# Altium schematic sheet RESET-SWITCHES.SchDoc
size A4; SheetNumber: 3; SheetTotal: 3
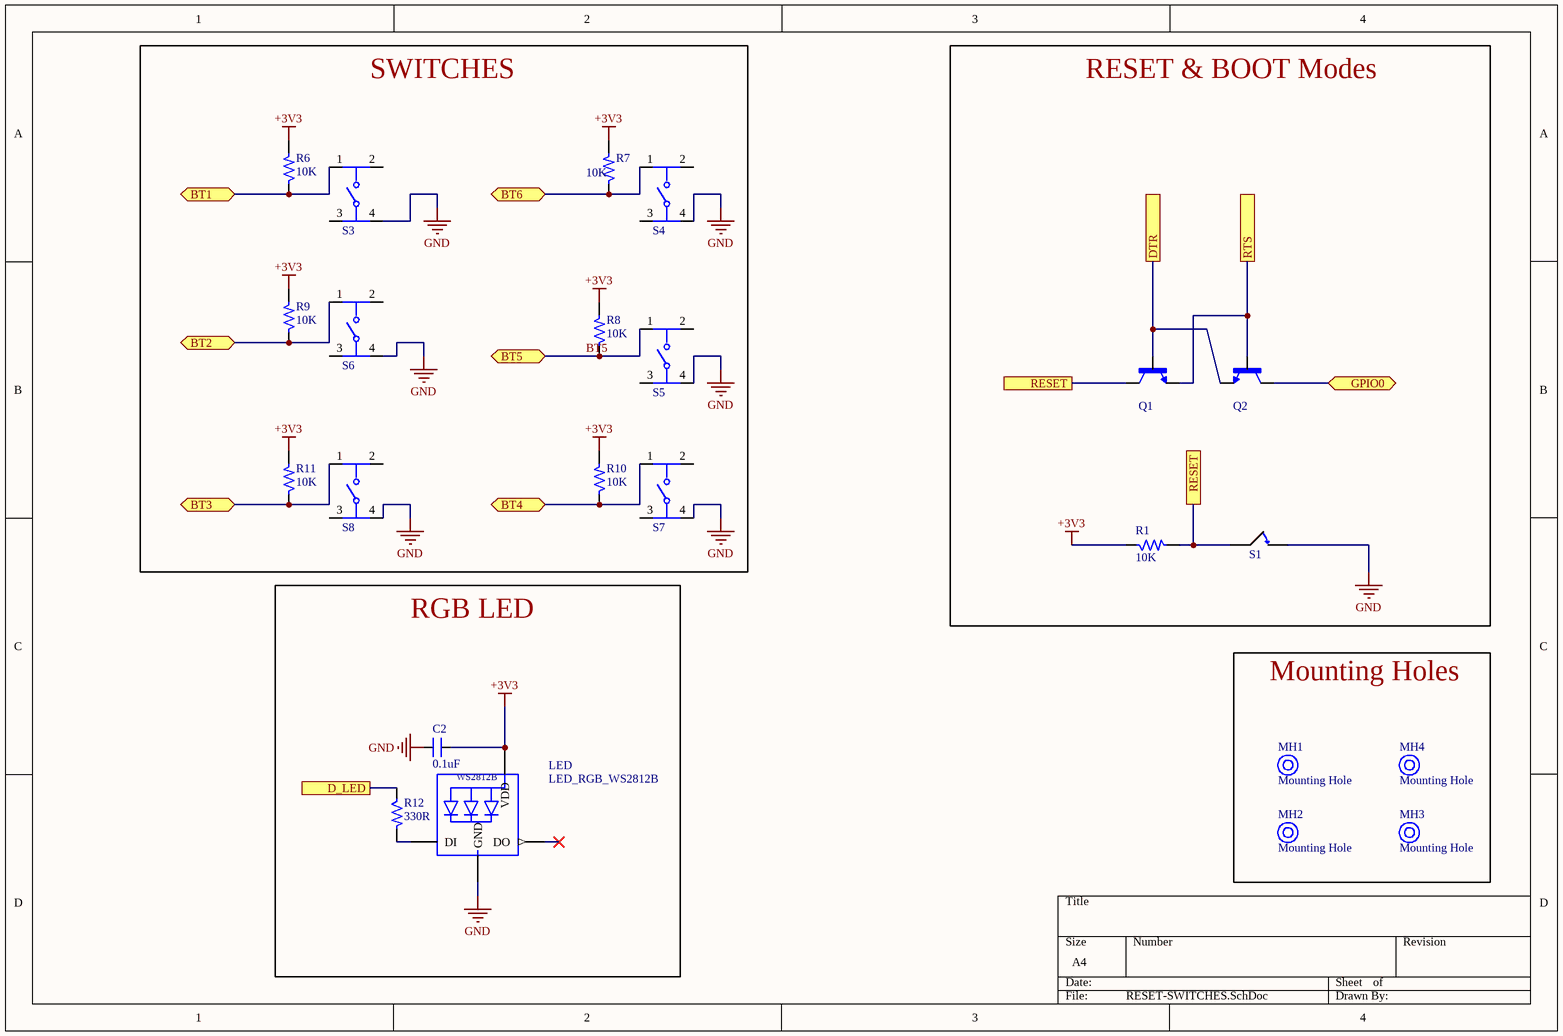
[diagram p0: RESET-SWITCHES.SchDoc]

## Parts
C2  0.1uF  [CAP_0805]
LED  LED_RGB_WS2812B  [WS2812B]
MH1  Mounting Hole  [MOUNTING-NO-COPPER]
MH2  Mounting Hole  [MOUNTING-NO-COPPER]
MH3  Mounting Hole  [MOUNTING-NO-COPPER]
MH4  Mounting Hole  [MOUNTING-NO-COPPER]
Q1  TRANS_NPN_SS8050-G  [TRANS_NPN_SS8050-G]  (value not drawn)
Q2  TRANS_NPN_SS8050-G  [TRANS_NPN_SS8050-G]  (value not drawn)
R1  10K  [RES_0805]
R6  10K  [RES_0805]
R7  10K  [RES_0805]
R8  10K  [RES_0805]
R9  10K  [RES_0805]
R10  10K  [RES_0805]
R11  10K  [RES_0805]
R12  330R  [RES_0805]
S1  Button Tactile Switch, NO 0.05 A 0.8mm  [Button8014X17N]  (value not drawn)
S3  SW_TACTILE_PTS645SM43SMTR92LFS  [C&K_0_MFG - duplicate]  (value not drawn)
S4  SW_TACTILE_PTS645SM43SMTR92LFS  [C&K_0_MFG - duplicate]  (value not drawn)
S5  SW_TACTILE_PTS645SM43SMTR92LFS  [C&K_0_MFG - duplicate]  (value not drawn)
S6  SW_TACTILE_PTS645SM43SMTR92LFS  [C&K_0_MFG - duplicate]  (value not drawn)
S7  SW_TACTILE_PTS645SM43SMTR92LFS  [C&K_0_MFG - duplicate]  (value not drawn)
S8  SW_TACTILE_PTS645SM43SMTR92LFS  [C&K_0_MFG - duplicate]  (value not drawn)

## Blocks framed on the sheet
SWITCHES: R6-R11 S3-S8
RESET & BOOT Modes: Q1 Q2 R1 S1
RGB LED: C2 LED R12
Mounting Holes: MH1-MH4

## Ports
BT1 (bidir), BT2 (bidir), BT3 (bidir), BT4 (bidir), BT5 (bidir), BT6 (bidir), D_LED, DTR, GPIO0 (bidir), RESET, RTS

## Nets
+3V3: C2.2 LED.1-VDD(VDD) R1.1 R6.2 R7.2 R8.2 R9.2 R10.2 R11.2
GND: C2.1 LED.3-GND(GND) S1.2 S3.4 S4.4 S5.4 S6.4 S7.4 S8.4
BT1: R6.1 S3.1 ; port BT1
BT2: R9.1 S6.1 ; port BT2
BT3: R11.1 S8.1 ; port BT3
BT4: R10.1 S7.1 ; port BT4
BT5: R8.1 S5.1 ; port BT5
BT6: R7.1 S4.1 ; port BT6
D_LED: R12.1 ; port D_LED
DTR: Q1.1(B) Q2.2(E) ; port DTR
GPIO0: Q2.3(C) ; port GPIO0
RESET: Q1.3(C) R1.2 S1.1 ; port RESET
RTS: Q1.2(E) Q2.1(B) ; port RTS
NetLED_4-DIN: LED.4-DIN(DI) R12.2

Not connected (* = marked no-connect by the designer): LED 2-DOUT(DO)*; S3 2 3; S4 2 3; S5 2 3; S6 2 3; S7 2 3; S8 2 3

## Library data of the parts
C2 = CAP_0.1uF-50V-10%-0805: 0.1µF ±10% 50V Ceramic Capacitor X7R 0805 (2012 Metric); Manufacturer: Samsung; Manufacturer Part Number: CL21B104KBCNNNC; Alternate Part Number-1: NA; Case/Package: 0805; Supplier-1: SIRICOM; Supplier Part Number-1: 0805B104K500CT
LED = LED_RGB_WS2812B: Raspberry Pi HAT _40 pin_ Wheeled Robotics Kit; MF: SparkFun Electronics; Availability: Unavailable; SnapEDA_Link: https://www.snapeda.com/parts/WS2812B/Worldsemi/view-part/1038297/?ref=snap; MP: WS2812B; Price: None; Value: *; Package: None
MH1-MH4 = MH_3H_ONLY_1: Manufacturer Part Number: NA; Case/Package: TH; Manufacturer: NA; Supplier-1: NA; Supplier Part Number-1: NA; Alternate Part Number-1: NA
Q1 Q2 = TRANS_NPN_SS8050-G: Bipolar (BJT) Transistor NPN 25 V 1.5 A 100MHz 300 mW Surface Mount SOT-23-3
R1 R6-R11 = RES_10K-0.125W-1%-0805: 10 kOhms ±1% 0.125W, 1/8W Chip Resistor 0805 (2012 Metric) Automotive AEC-Q200 Thick Film; Manufacturer: CTS; Manufacturer Part Number: WR08X1002FTL; Case/Package: 0805; Supplier-1: SIRICOM; Supplier Part Number-1: WR08X1002FTL; Alternate Part Number-1: WR08X1002FTL
R12 = RES_330R-0.125W-1%-0805: 330 Ohms ±1% 0.125W, 1/8W Chip Resistor 0805 (2012 Metric) Automotive AEC-Q200 Thick Film; Manufacturer: Walsin; Manufacturer Part Number: WR08X3300FTL; Alternate Part Number-1: NA; Case/Package: 0805; Supplier-1: SIRICOM; Supplier Part Number-1: WR08X3300FTL
S1 = Button Tactile Switch, NO 0.05 A 0.8mm: Manufacturer: C & K; Manufacturer Part No.: B3F1000; State: Normaly Open; Date Created: 25 February 2015; Creator: R Kanjee; RS Stock No.: 516-255